# Altium schematic sheet HF_AMP_DRIVER.SchDoc
size A4; Organization: MAHLE International GmbH; Address1: Pragstr. 26 - 46; Address2: 70376 Stuttgart; Address3: Germany; DocumentNumber: 2; SheetNumber: 2; SheetTotal: 3
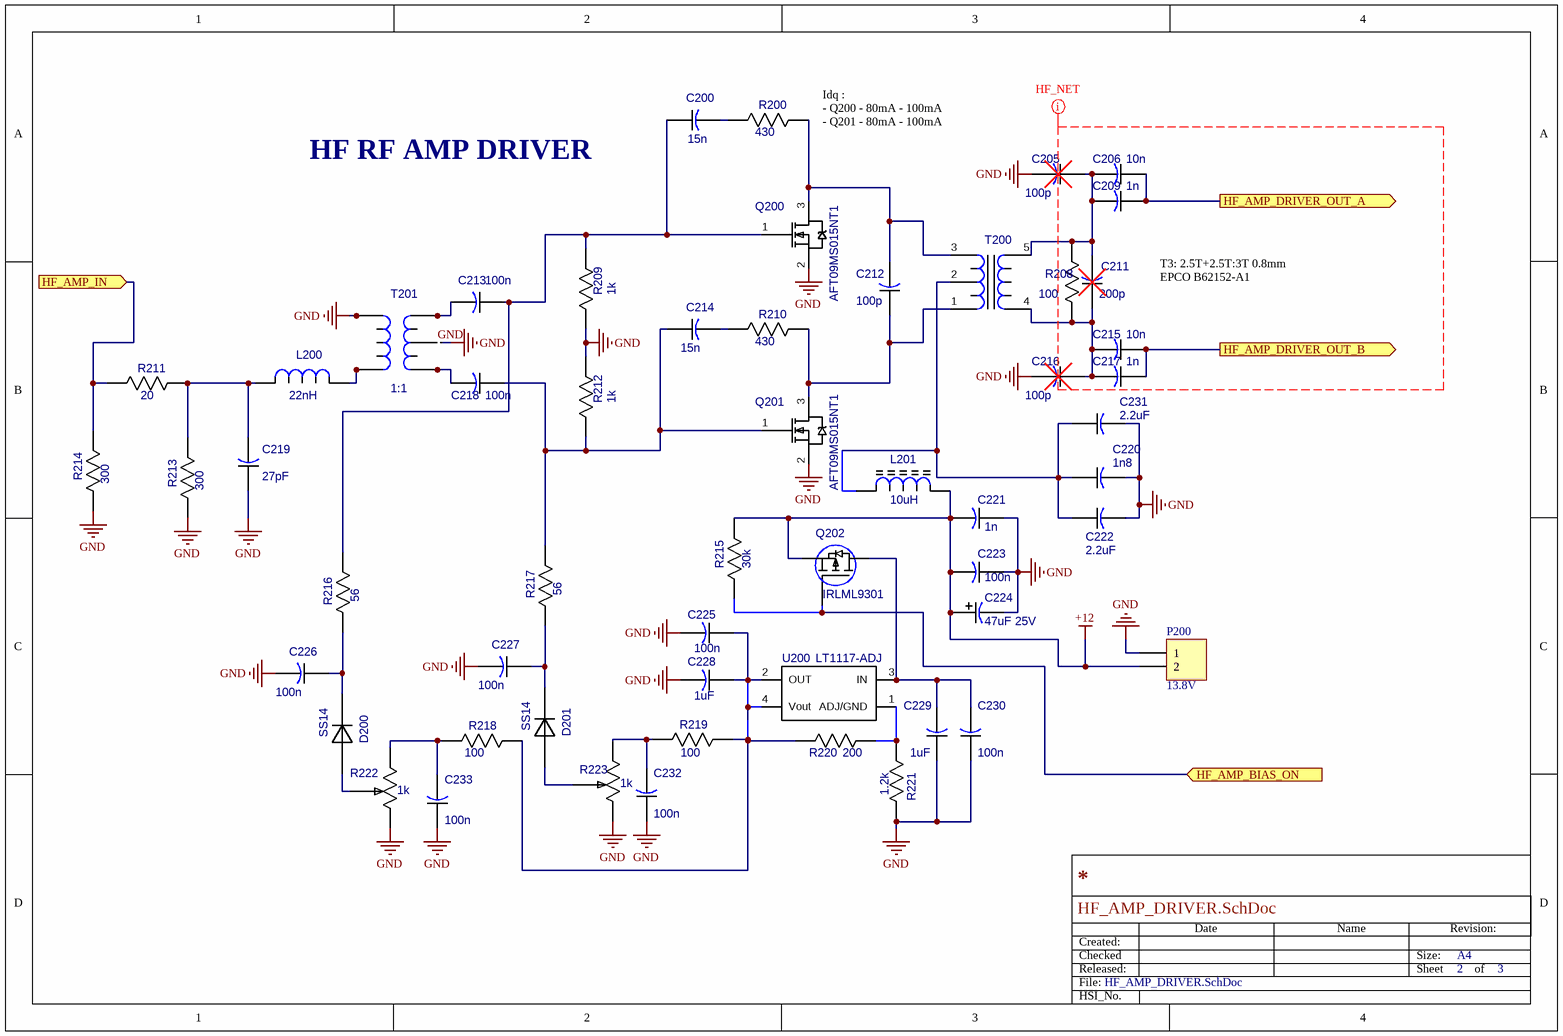
[diagram p0: HF_AMP_DRIVER.SchDoc]

## Parts
C200  15n  [CAP_0805]
C205  100p  [CAP_1206]
C206  10n  [CAP_1206]
C209  1n  [CAP_1206]
C211  200p  [CAP_1206]
C212  100p  [CAP_1206]
C213  100n  [CAP_0805]
C214  15n  [CAP_0805]
C215  10n  [CAP_1206]
C216  100p  [CAP_1206]
C217  1n  [CAP_1206]
C218  100n  [CAP_0805]
C219  27pF  [CAP_0805]
C220  1n8  [CAP_1206]
C221  1n  [CAP_0805]
C222  2.2uF  [CAP_1206]
C223  100n  [CAP_0805]
C224  47uF 25V  [CAPAE_6.6x6.6h5.4]
C225  100n  [CAP_0805]
C226  100n  [CAP_0805]
C227  100n  [CAP_0805]
C228  1uF  [CAP_0805]
C229  1uF  [CAP_0805]
C230  100n  [CAP_0805]
C231  2.2uF  [CAP_1206]
C232  100n  [CAP_0805]
C233  100n  [CAP_0805]
D200  SS14  [SS14]
D201  SS14  [SS14]
L200  22nH  [IND_0805]
L201  10uH  [IND_FERRITE_CORE]
P200  13.8V  [2 Pole Screw]
Q200  AFT09MS015NT1  [AFT09MS015NT1]
Q201  AFT09MS015NT1  [AFT09MS015NT1]
Q202  IRLML9301  [SOT23]
R200  430  [RES_0805]
R208  100  [RES_1206]
R209  1k  [RES_0805]
R210  430  [RES_0805]
R211  20  [RES_1206]
R212  1k  [RES_0805]
R213  300  [RES_1206]
R214  300  [RES_1206]
R215  30k  [RES_0805]
R216  56  [RES_0805]
R217  56  [RES_0805]
R218  100  [RES_0805]
R219  100  [RES_0805]
R220  200  [RES_0805]
R221  1.2k  [RES_0805]
R222  value 1k  [306J]  (hidden comment: ADJ-1k)
R223  value 1k  [306J]  (hidden comment: ADJ-1k)
T200  TRANSF_HF3  [TRANSF_HF3]  (value not drawn)
T201  1:1  [TRANSF_ACORE2]
U200  value LT1117-ADJ  [LT1117IST-ADJ]  (hidden comment: LT1117IST-ADJ)

## Ports
HF_AMP_BIAS_ON (in), HF_AMP_DRIVER_OUT_A (out), HF_AMP_DRIVER_OUT_B (out), HF_AMP_IN (in)

## Nets
+12: C221.2 C223.2 C224.1(PLUS) L201.2(B) P200.2 Q202.2(S) R215.2
GND: C205.2 C216.2 C219.1 C220.2 C221.1 C222.2 C223.1 C224.2(MINUS) C225.2 C226.2 C227.2 C228.2 C229.1 C230.1 C231.2 C232.1 C233.1 P200.1 Q200.2(S) Q201.2(S) R209.1 R212.2 R213.1 R214.1 R221.2 R222.1(CCW) R223.1(CCW) T201.2(S2) T201.4(P2) T201.8(S2) T201.11
HF_AMP_BIAS_ON: Q202.1(G) R215.1 ; port HF_AMP_BIAS_ON
HF_AMP_DRIVER_OUT_A: C206.1 C209.1 ; port HF_AMP_DRIVER_OUT_A
HF_AMP_DRIVER_OUT_B: C215.1 C217.1 ; port HF_AMP_DRIVER_OUT_B
HF_AMP_IN: R211.1 R214.2 ; port HF_AMP_IN
NetC200_1: C200.1 C213.1 Q200.1(G) R209.2 R216.2
NetC200_2: C200.2 R200.1
NetC205_1: C205.1 C206.2 C209.2 C211.2 R208.2 T200.5(P1)
NetC211_1: C211.1 C215.2 C216.1 C217.2 R208.1 T200.4(P2)
NetC212_1: C212.1 Q201.3(D) R210.2 T200.1(S2)
NetC212_2: C212.2 Q200.3(D) R200.2 T200.3(S1)
NetC213_2: C213.2 T201.3(S3) T201.9
NetC214_1: C214.1 C218.1 Q201.1(G) R212.1 R217.2
NetC214_2: C214.2 R210.1
NetC218_2: C218.2 T201.1(S1) T201.7
NetC219_2: C219.2 L200.1 R211.2 R213.2
NetC220_1: C220.1 C222.1 C231.1 L201.1(A) T200.2(S3)
NetC225_1: C225.1 C228.1 R218.2 R219.2 R220.1 U200.2(OUT) U200.4(Vout)
NetC226_1: C226.1 D200.1(K) R216.1
NetC227_1: C227.1 D201.1(K) R217.1
NetC229_2: C229.2 C230.2 Q202.3(D) U200.3(IN)
NetC232_2: C232.2 R219.1 R223.3(CW)
NetC233_2: C233.2 R218.1 R222.3(CW)
NetD200_2: D200.2(A) R222.2(W)
NetD201_2: D201.2(A) R223.2(W)
NetL200_2: L200.2 T201.6(P1) T201.10
NetR220_2: R220.2 R221.1 U200.1(ADJ/GND)

## Layout directives
net class HF_NET: (no net found under the mark)

## Notes on the sheet
- HF RF AMP DRIVER
- (near R200) Idq :
  - Q200 - 80mA - 100mA
  - Q201 - 80mA - 100mA
- T3: 2.5T+2.5T:3T 0.8mm
  EPCO B62152-A1
- File:
- Created:
- Checked
- Released:
- Date
- Name
- Size:
- Sheet
- Revision:
- A4
- of
- HSI_No.

## Library data of the parts
C200 C205 C206 C209 C211 C212 C214-C217 C220 C222 C231 = CAP_1206
C213 C218 C219 C221 C223 C225-C230 C232 C233 = CAP_0805
  C221: Value: 1n
  C223 C225-C227 C230 C232 C233: Value: 100n
  C228 C229: Value: 1uF
C224 = CAPAE_6.6x6.6h5.4: Value: 47uF 25V
L200 = IND_0805
L201 = IND_FERRITE_CORE: Inductor; Value: 10uH
P200 = Header 2: Header, 2-Pin; LatestRevisionDate: 17-Jul-2002; LatestRevisionNote: Re-released for DXP Platform.; Publisher: Altium Limited
Q202 = MOSFET_ENH_PD: MOSFET; Value: IRLML9301
R200 R208 R210 R211 R213 R214 = RES_1206
R209 R212 R215-R221 = RES_0805
  R209 R212: Value: 1k
  R215: Value: 30k
  R216 R217: Value: 56
  R220: Value: 200
  R221: Value: 1.2k
R222 R223 = 306J
T200 = TRANSF_RF3: Value: *
T201 = TRANSF_ACORE2: Value: 1:1
D200 D201 = SS14: Value: SS14
Q200 Q201 = AFT09MS015NT1: Value: *